# EAGLE design TMP36-Eagle (EAGLE 9.6.0)
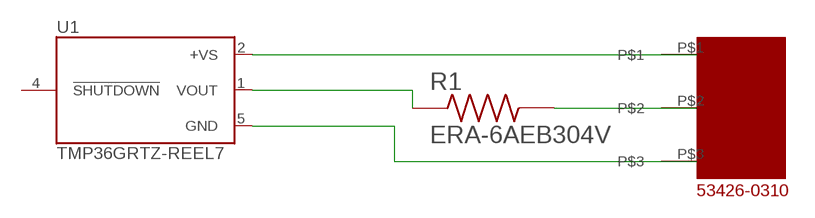
[diagram p0: schematic, sheet 1]

## Parts
R1  ERA-6AEB304V  [RESC2012X60N]
U1  TMP36GRTZ-REEL7  [SOT95P280X145-5N]
U$6  53426-0310  [53426-0310]

## Nets
N$1: R1.1 U1.1(VOUT)
N$2: U1.2(+VS) U$6.P$1
N$3: U1.5(GND) U$6.P$3
N$4: R1.2 U$6.P$2
Unconnected: U1.4(!SHUTDOWN)

## Library data of the parts
R1 = ERA-6AEB304V:ERA-6AEB304V: ERA Series 0805 300 kO ±0.1 % 0.125 W ±25 ppm/°C Molded Thin Film Chip Resistor; AVAILABILITY: Unavailable; DESCRIPTION: 300 kOhms ±0.1% 0.125W, 1/8W Chip Resistor 0805 _2012 Metric_ Automotive AEC-Q200 Thin Film; MF: Panasonic; MP: ERA-6AEB304V; PACKAGE: 2012 Panasonic Electronic Components; PRICE: None
U1 = TMP36GRTZ-REEL7:TMP36GRTZ-REEL7: Temp Sensor Analog(Voltage) Serial (2-Wire) 5-Pin Sot-23 T/R; AVAILABILITY: Unavailable; DESCRIPTION: Temperature Sensor Analog, Local -40°C ~ 125°C 10mV/°C SOT-23-5; MF: Analog Devices; MP: TMP36GRTZ-REEL7; PACKAGE: SOT-23-5 Analog Devices; PRICE: None
U$6 = my-library:53426-0310

## Module TMP36
Ports: 

### Library data of the parts

## Board
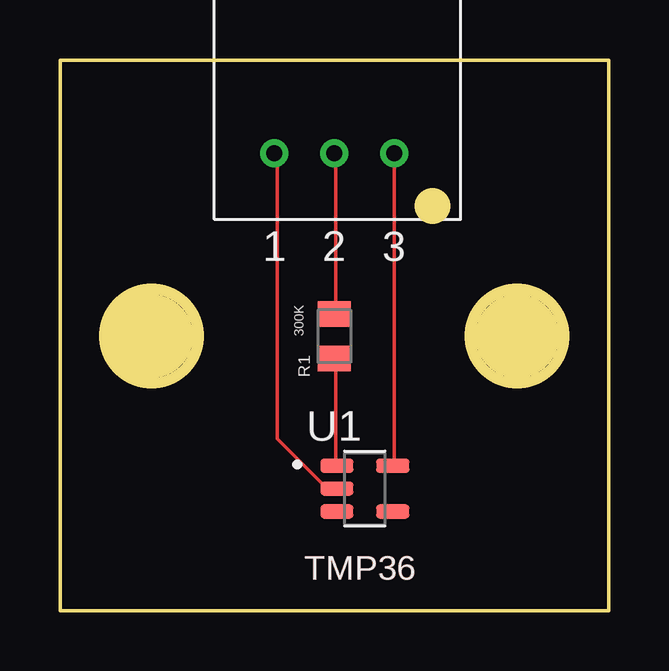
[diagram p1: board, top side]

Size 22.86 x 22.94 mm. Coordinates in mm from the lower left corner, seen from the top.
Outline: 0,22.94 0,0 22.86,0 22.86,22.94 0,22.94
Copper layers (1*16): Top 0.035mm / dielectric 1.5mm / Bottom 0.035mm
Design rules "default": minimum track width 6mil, minimum drill 0.35mm, track to track 6mil, track to pad 6mil, pad to pad 6mil, via to via 6mil, smd to smd 6mil, copper to edge 40mil, drill to drill 6mil, minimum pad ring 10mil, minimum via ring 8mil, stop-mask expansion 4mil, vias tented up to drill 0mil, thermal gap 10mil
Milling: area 17,9.4 to 21.1,13.5; area 1.8,9.4 to 5.9,13.5; area 1.9,9.5 to 5.7,13.3; area 2.5,10.2 to 5.1,12.7; area 2.7,10.3 to 5,12.6; area 2,9.6 to 5.6,13.2; area 2.2,9.8 to 5.5,13.1; area 2.3,9.9 to 5.3,13; area 2.4,10 to 5.2,12.8; area 2.7,10.3 to 5,12.6; area 2.8,10.4 to 4.8,12.4; area 3,10.7 to 4.6,12.2; 40 more areas

### Footprints (pad centres in the part's own frame; a part is rotated, then mirrored left to right if it is on the bottom)
RESC2012X60N = smd 1.06 x 1.38: 1 -0.925,0; 2 0.925,0
SOT95P280X145-5N = smd 1.39 x 0.6: 1 -1.165,0.95; 2 -1.165,0; 3 -1.165,-0.95; 4 1.165,-0.95; 5 1.165,0.95
53426-0310 = drill 0.66: P$1 -2.5,0; P$2 0,0; P$3 2.5,0

### Placement (x,y rotation side)
R1  11.43,11.43 90 top
U1  12.7,5.08 0 top
U$6  11.43,19.05 0 top

### Tracks (layer width: path | path; a pad name or v marks a point on that pad's centre or on a via)
N$1
  Top 0.152: R1.1 11.48,10.36 11.48,6.1 U1.1
N$2
  Top 0.152: U$6.P$1 9.04,18.94 9.04,7.16 11.02,5.18 11.48,5.18 U1.2
N$3
  Top 0.152: U1.5 13.92,6.1 U$6.P$3
N$4
  Top 0.152: R1.2 11.48,12.5 11.48,19.05 U$6.P$2

### Text on the board
Top: TMP36
tPlace: 300K | TMP36
Document: These are holes / for mounting screws | These are holes / for mounting screws